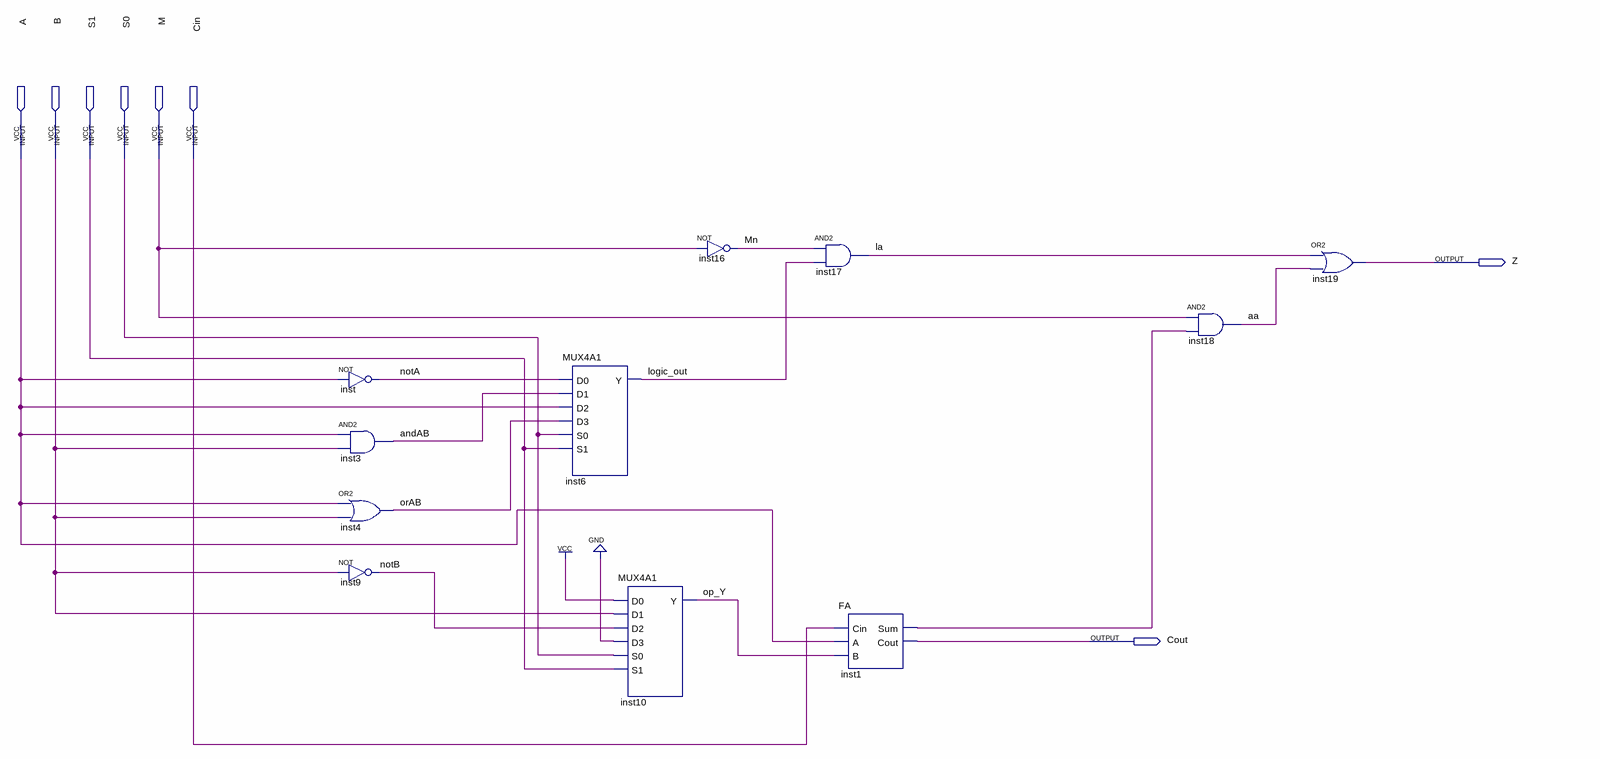
[diagram p0: schematic sheet]
// Quartus schematic ALU1BIT.bdf as structural Verilog: 11 symbols, 8 pins
module ALU1BIT (
  input  A,
  input  B,
  input  S1,
  input  S0,
  input  M,
  input  Cin,
  output Z,
  output Cout
);

  wire aa, andAB, inst1_sum, la, logic_out, Mn, notA, notB, op_Y, orAB;

  not inst (notA, A);
  and inst3 (andAB, A, B);
  or inst4 (orAB, A, B);
  not inst9 (notB, B);
  MUX4A1 inst6 (.D0(notA), .D1(andAB), .D2(A), .D3(orAB), .S0(S0), .S1(S1), .Y(logic_out));
  MUX4A1 inst10 (.D0(1'b1), .D1(B), .D2(notB), .D3(1'b0), .S0(S0), .S1(S1), .Y(op_Y));
  not inst16 (Mn, M);
  and inst17 (la, Mn, logic_out);
  FA inst1 (.Cin(Cin), .A(A), .B(op_Y), .Sum(inst1_sum), .Cout(Cout));
  and inst18 (aa, M, inst1_sum);
  or inst19 (Z, la, aa);
endmodule
